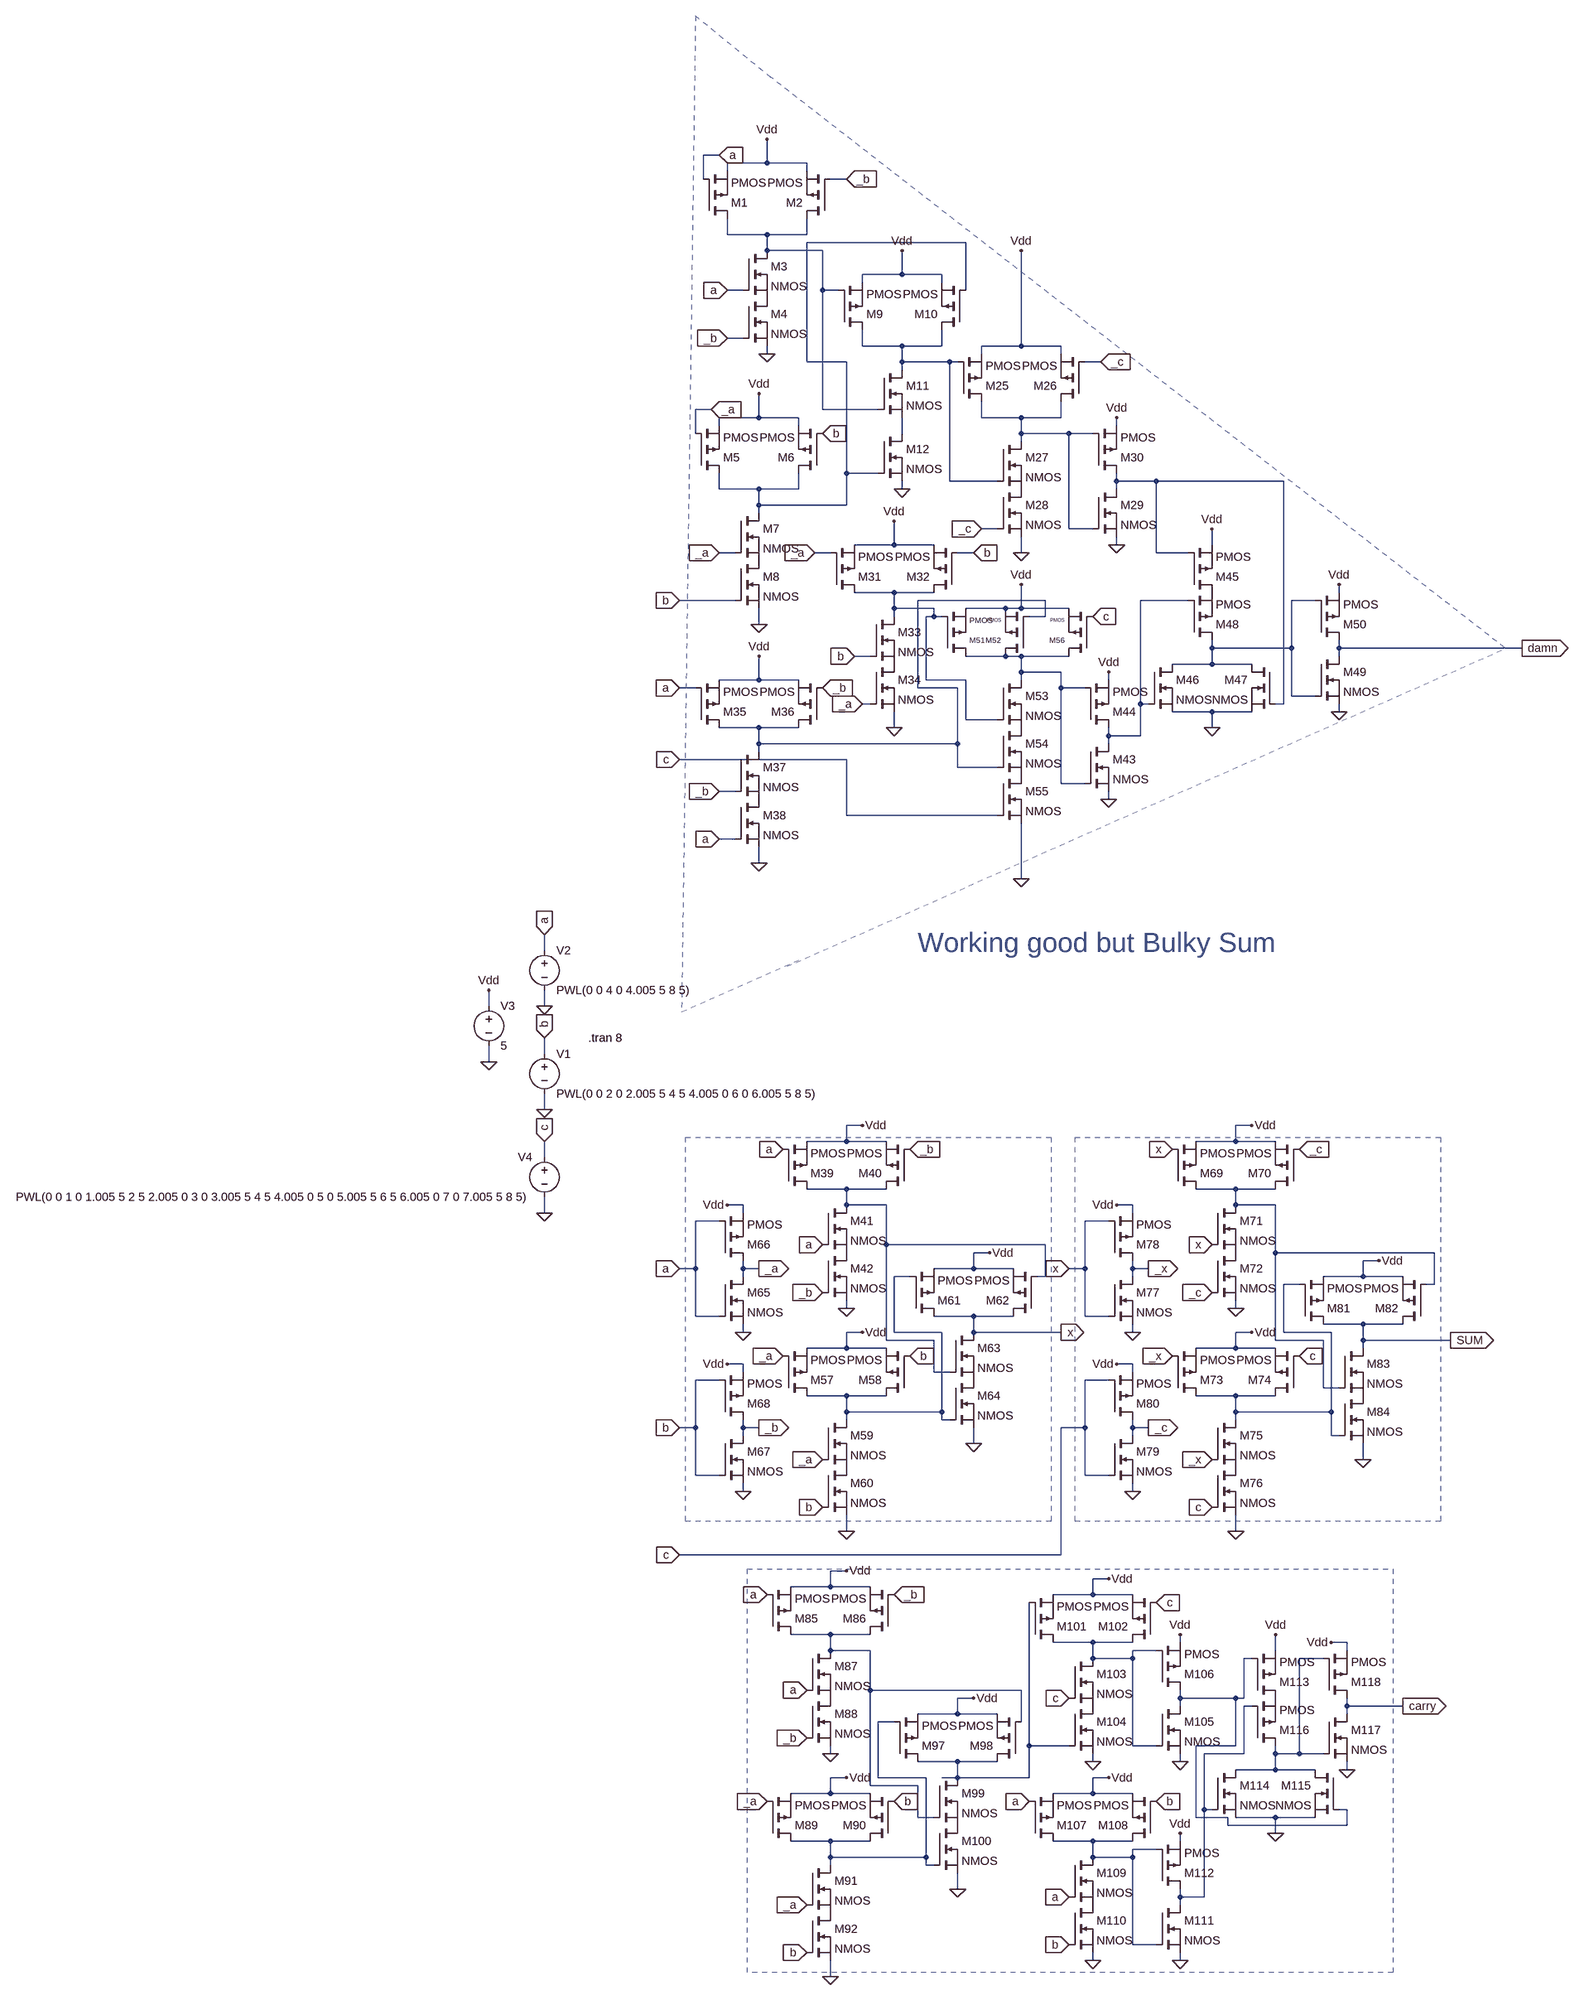
[diagram p0: schematic Full adder.asc]
Full adder.asc, the LTspice schematic file:
Version 4
SHEET 1 3796 2696
WIRE 816 -2448 784 -2448
WIRE 912 -2432 912 -2480
WIRE 912 -2432 832 -2432
WIRE 992 -2432 912 -2432
WIRE 832 -2416 832 -2432
WIRE 992 -2416 992 -2432
WIRE 784 -2400 784 -2448
WIRE 1072 -2400 1040 -2400
WIRE 832 -2288 832 -2320
WIRE 912 -2288 832 -2288
WIRE 992 -2288 992 -2320
WIRE 992 -2288 912 -2288
WIRE 1312 -2272 992 -2272
WIRE 912 -2256 912 -2288
WIRE 1024 -2256 912 -2256
WIRE 1184 -2208 1184 -2256
WIRE 1184 -2208 1104 -2208
WIRE 1264 -2208 1184 -2208
WIRE 1104 -2192 1104 -2208
WIRE 1264 -2192 1264 -2208
WIRE 864 -2176 832 -2176
WIRE 1024 -2176 1024 -2256
WIRE 1056 -2176 1024 -2176
WIRE 1312 -2176 1312 -2272
WIRE 864 -2080 832 -2080
WIRE 1104 -2064 1104 -2096
WIRE 1184 -2064 1104 -2064
WIRE 1264 -2064 1264 -2096
WIRE 1264 -2064 1184 -2064
WIRE 1424 -2064 1424 -2256
WIRE 1424 -2064 1344 -2064
WIRE 1504 -2064 1424 -2064
WIRE 912 -2048 912 -2064
WIRE 1344 -2048 1344 -2064
WIRE 1504 -2048 1504 -2064
WIRE 992 -2032 992 -2272
WIRE 1072 -2032 992 -2032
WIRE 1184 -2032 1184 -2064
WIRE 1280 -2032 1184 -2032
WIRE 1296 -2032 1280 -2032
WIRE 1584 -2032 1552 -2032
WIRE 1184 -2016 1184 -2032
WIRE 800 -1936 768 -1936
WIRE 1024 -1936 1024 -2176
WIRE 1136 -1936 1024 -1936
WIRE 896 -1920 896 -1968
WIRE 896 -1920 816 -1920
WIRE 976 -1920 896 -1920
WIRE 1344 -1920 1344 -1952
WIRE 1424 -1920 1344 -1920
WIRE 1504 -1920 1504 -1952
WIRE 1504 -1920 1424 -1920
WIRE 816 -1904 816 -1920
WIRE 976 -1904 976 -1920
WIRE 1616 -1904 1616 -1920
WIRE 768 -1888 768 -1936
WIRE 1184 -1888 1184 -1920
WIRE 1424 -1888 1424 -1920
WIRE 1520 -1888 1424 -1888
WIRE 1568 -1888 1520 -1888
WIRE 1424 -1872 1424 -1888
WIRE 1072 -1808 1072 -2032
WIRE 1136 -1808 1072 -1808
WIRE 1280 -1792 1280 -2032
WIRE 1376 -1792 1280 -1792
WIRE 1616 -1792 1616 -1808
WIRE 1696 -1792 1616 -1792
WIRE 1952 -1792 1696 -1792
WIRE 816 -1776 816 -1808
WIRE 896 -1776 816 -1776
WIRE 976 -1776 976 -1808
WIRE 976 -1776 896 -1776
WIRE 1184 -1776 1184 -1792
WIRE 1616 -1776 1616 -1792
WIRE 896 -1744 896 -1776
WIRE 1072 -1744 1072 -1808
WIRE 1072 -1744 896 -1744
WIRE 896 -1728 896 -1744
WIRE 1376 -1696 1344 -1696
WIRE 1520 -1696 1520 -1888
WIRE 1568 -1696 1520 -1696
WIRE 1168 -1664 1168 -1712
WIRE 1168 -1664 1088 -1664
WIRE 1248 -1664 1168 -1664
WIRE 1616 -1664 1616 -1680
WIRE 1808 -1664 1808 -1696
WIRE 848 -1648 816 -1648
WIRE 1040 -1648 1008 -1648
WIRE 1328 -1648 1296 -1648
WIRE 1424 -1648 1424 -1680
WIRE 1696 -1648 1696 -1792
WIRE 1760 -1648 1696 -1648
WIRE 1168 -1568 1088 -1568
WIRE 1248 -1568 1168 -1568
WIRE 2064 -1568 2064 -1584
WIRE 848 -1552 736 -1552
WIRE 1472 -1552 1216 -1552
WIRE 1760 -1552 1664 -1552
WIRE 2016 -1552 1968 -1552
WIRE 1168 -1536 1168 -1568
WIRE 1248 -1536 1168 -1536
WIRE 1392 -1536 1312 -1536
WIRE 1424 -1536 1424 -1584
WIRE 1424 -1536 1392 -1536
WIRE 1520 -1536 1424 -1536
WIRE 1168 -1520 1168 -1536
WIRE 1248 -1520 1248 -1536
WIRE 1248 -1520 1232 -1520
WIRE 1264 -1520 1248 -1520
WIRE 1472 -1520 1472 -1552
WIRE 1472 -1520 1440 -1520
WIRE 896 -1504 896 -1536
WIRE 1808 -1456 1808 -1472
WIRE 1968 -1456 1968 -1552
WIRE 1968 -1456 1808 -1456
WIRE 2064 -1456 2064 -1472
WIRE 2432 -1456 2064 -1456
WIRE 1120 -1440 1088 -1440
WIRE 1392 -1440 1312 -1440
WIRE 1424 -1440 1392 -1440
WIRE 1520 -1440 1424 -1440
WIRE 2064 -1440 2064 -1456
WIRE 1808 -1424 1808 -1456
WIRE 1808 -1424 1728 -1424
WIRE 1888 -1424 1808 -1424
WIRE 1424 -1408 1424 -1440
WIRE 1504 -1408 1424 -1408
WIRE 896 -1392 896 -1440
WIRE 896 -1392 816 -1392
WIRE 976 -1392 896 -1392
WIRE 1232 -1392 1232 -1520
WIRE 1312 -1392 1232 -1392
WIRE 1424 -1392 1424 -1408
WIRE 1600 -1392 1600 -1408
WIRE 768 -1376 736 -1376
WIRE 1216 -1376 1216 -1552
WIRE 1296 -1376 1216 -1376
WIRE 1504 -1376 1504 -1408
WIRE 1552 -1376 1504 -1376
WIRE 1968 -1360 1968 -1456
WIRE 2016 -1360 1968 -1360
WIRE 1120 -1344 1104 -1344
WIRE 1664 -1344 1664 -1552
WIRE 1680 -1344 1664 -1344
WIRE 1952 -1344 1952 -1792
WIRE 1952 -1344 1936 -1344
WIRE 1808 -1328 1728 -1328
WIRE 1888 -1328 1808 -1328
WIRE 2064 -1328 2064 -1344
WIRE 1312 -1312 1312 -1392
WIRE 1376 -1312 1312 -1312
WIRE 896 -1296 816 -1296
WIRE 976 -1296 896 -1296
WIRE 1168 -1296 1168 -1328
WIRE 1808 -1296 1808 -1328
WIRE 1600 -1280 1600 -1296
WIRE 1664 -1280 1664 -1344
WIRE 1664 -1280 1600 -1280
WIRE 896 -1264 896 -1296
WIRE 1296 -1264 1296 -1376
WIRE 1296 -1264 896 -1264
WIRE 1600 -1264 1600 -1280
WIRE 896 -1248 896 -1264
WIRE 1072 -1232 736 -1232
WIRE 1296 -1216 1296 -1264
WIRE 1376 -1216 1296 -1216
WIRE 1504 -1184 1504 -1376
WIRE 1552 -1184 1504 -1184
WIRE 848 -1168 816 -1168
WIRE 1600 -1152 1600 -1168
WIRE 1072 -1120 1072 -1232
WIRE 1376 -1120 1072 -1120
WIRE 848 -1072 816 -1072
WIRE 896 -1024 896 -1056
WIRE 1424 -992 1424 -1104
WIRE 464 -848 464 -880
WIRE 352 -736 352 -768
WIRE 464 -736 464 -768
WIRE 464 -640 464 -672
WIRE 352 -624 352 -656
WIRE 464 -528 464 -560
WIRE 1104 -496 1072 -496
WIRE 1888 -496 1856 -496
WIRE 1072 -464 1072 -496
WIRE 1072 -464 992 -464
WIRE 1152 -464 1072 -464
WIRE 1856 -464 1856 -496
WIRE 1856 -464 1776 -464
WIRE 1936 -464 1856 -464
WIRE 464 -432 464 -464
WIRE 1072 -368 992 -368
WIRE 1152 -368 1072 -368
WIRE 1856 -368 1776 -368
WIRE 1936 -368 1856 -368
WIRE 864 -336 832 -336
WIRE 1072 -336 1072 -368
WIRE 1152 -336 1072 -336
WIRE 1648 -336 1616 -336
WIRE 1856 -336 1856 -368
WIRE 1936 -336 1856 -336
WIRE 464 -320 464 -352
WIRE 864 -320 864 -336
WIRE 1648 -320 1648 -336
WIRE 816 -304 768 -304
WIRE 1600 -304 1552 -304
WIRE 1152 -256 1152 -336
WIRE 1472 -256 1152 -256
WIRE 1360 -240 1328 -240
WIRE 1936 -240 1936 -336
WIRE 2256 -240 1936 -240
WIRE 2144 -224 2112 -224
WIRE 768 -208 768 -304
WIRE 768 -208 736 -208
WIRE 864 -208 864 -224
WIRE 896 -208 864 -208
WIRE 1328 -208 1328 -240
WIRE 1328 -208 1248 -208
WIRE 1408 -208 1328 -208
WIRE 1552 -208 1552 -304
WIRE 1552 -208 1520 -208
WIRE 1648 -208 1648 -224
WIRE 1680 -208 1648 -208
WIRE 864 -192 864 -208
WIRE 1200 -192 1168 -192
WIRE 1472 -192 1472 -256
WIRE 1472 -192 1456 -192
WIRE 1648 -192 1648 -208
WIRE 2112 -192 2112 -224
WIRE 2112 -192 2032 -192
WIRE 2192 -192 2112 -192
WIRE 1984 -176 1952 -176
WIRE 2256 -176 2256 -240
WIRE 2256 -176 2240 -176
WIRE 1072 -128 1072 -144
WIRE 1856 -128 1856 -144
WIRE 768 -112 768 -208
WIRE 816 -112 768 -112
WIRE 1328 -112 1248 -112
WIRE 1408 -112 1328 -112
WIRE 1552 -112 1552 -208
WIRE 1600 -112 1552 -112
WIRE 2112 -96 2032 -96
WIRE 2192 -96 2112 -96
WIRE 864 -80 864 -96
WIRE 1104 -80 1072 -80
WIRE 1168 -80 1168 -192
WIRE 1264 -80 1168 -80
WIRE 1328 -80 1328 -112
WIRE 1504 -80 1328 -80
WIRE 1648 -80 1648 -96
WIRE 1888 -80 1856 -80
WIRE 1952 -80 1952 -176
WIRE 2048 -80 1952 -80
WIRE 1152 -64 1152 -256
WIRE 1248 -64 1152 -64
WIRE 1328 -64 1328 -80
WIRE 1936 -64 1936 -240
WIRE 2032 -64 1936 -64
WIRE 2112 -64 2112 -96
WIRE 2288 -64 2112 -64
WIRE 1072 -48 1072 -80
WIRE 1072 -48 992 -48
WIRE 1152 -48 1072 -48
WIRE 1856 -48 1856 -80
WIRE 1856 -48 1776 -48
WIRE 1936 -48 1856 -48
WIRE 2112 -48 2112 -64
WIRE 864 -16 832 -16
WIRE 1648 -16 1616 -16
WIRE 864 0 864 -16
WIRE 1248 0 1248 -64
WIRE 1280 0 1248 0
WIRE 1648 0 1648 -16
WIRE 816 16 768 16
WIRE 1600 16 1552 16
WIRE 2032 32 2032 -64
WIRE 2064 32 2032 32
WIRE 1072 48 992 48
WIRE 1152 48 1072 48
WIRE 1856 48 1776 48
WIRE 1936 48 1856 48
WIRE 1072 80 1072 48
WIRE 1264 80 1264 -80
WIRE 1264 80 1072 80
WIRE 1856 80 1856 48
WIRE 2048 80 2048 -80
WIRE 2048 80 1856 80
WIRE 1072 96 1072 80
WIRE 1264 96 1264 80
WIRE 1280 96 1264 96
WIRE 1856 96 1856 80
WIRE 768 112 768 16
WIRE 768 112 736 112
WIRE 864 112 864 96
WIRE 896 112 864 112
WIRE 1552 112 1552 16
WIRE 1552 112 1504 112
WIRE 1648 112 1648 96
WIRE 1680 112 1648 112
WIRE 864 128 864 112
WIRE 1648 128 1648 112
WIRE 2048 128 2048 80
WIRE 2064 128 2048 128
WIRE 1328 144 1328 112
WIRE 2112 176 2112 144
WIRE 768 208 768 112
WIRE 816 208 768 208
WIRE 1552 208 1552 112
WIRE 1600 208 1552 208
WIRE 864 240 864 224
WIRE 1648 240 1648 224
WIRE 1072 320 1072 288
WIRE 1856 320 1856 288
WIRE 1504 368 1504 112
WIRE 1504 368 736 368
WIRE 1072 400 1040 400
WIRE 1600 416 1568 416
WIRE 1040 432 1040 400
WIRE 1040 432 960 432
WIRE 1120 432 1040 432
WIRE 1568 448 1568 416
WIRE 1568 448 1488 448
WIRE 1648 448 1568 448
WIRE 1040 528 960 528
WIRE 1120 528 1040 528
WIRE 1568 544 1488 544
WIRE 1648 544 1568 544
WIRE 1744 544 1744 528
WIRE 2080 544 2048 544
WIRE 1040 560 1040 528
WIRE 1120 560 1040 560
WIRE 1696 560 1648 560
WIRE 1936 560 1936 528
WIRE 2080 560 2080 544
WIRE 1568 576 1568 544
WIRE 1648 576 1648 560
WIRE 1648 576 1568 576
WIRE 1888 576 1872 576
WIRE 2032 576 1984 576
WIRE 1120 640 1120 560
WIRE 1424 640 1120 640
WIRE 1328 656 1296 656
WIRE 1744 656 1744 640
WIRE 1856 656 1744 656
WIRE 1872 656 1872 576
WIRE 1872 656 1856 656
WIRE 1744 672 1744 656
WIRE 1888 672 1872 672
WIRE 2080 672 2080 656
WIRE 2192 672 2080 672
WIRE 1296 688 1296 656
WIRE 1296 688 1216 688
WIRE 1376 688 1296 688
WIRE 2080 688 2080 672
WIRE 1168 704 1136 704
WIRE 1424 704 1424 640
WIRE 1440 752 1440 464
WIRE 1520 752 1440 752
WIRE 1648 752 1648 576
WIRE 1696 752 1648 752
WIRE 1856 752 1856 656
WIRE 1856 752 1776 752
WIRE 1040 768 1040 752
WIRE 1872 768 1872 672
WIRE 1872 768 1792 768
WIRE 1936 768 1936 752
WIRE 1984 768 1984 576
WIRE 1984 768 1936 768
WIRE 2032 768 1984 768
WIRE 1296 784 1216 784
WIRE 1376 784 1296 784
WIRE 1568 784 1568 768
WIRE 1744 784 1744 768
WIRE 1936 800 1936 768
WIRE 1936 800 1856 800
WIRE 2016 800 1936 800
WIRE 2080 800 2080 784
WIRE 1072 816 1040 816
WIRE 1136 816 1136 704
WIRE 1232 816 1136 816
WIRE 1296 816 1296 784
WIRE 1296 816 1264 816
WIRE 1440 816 1440 752
WIRE 1440 816 1296 816
WIRE 1600 816 1568 816
WIRE 1120 832 1120 640
WIRE 1216 832 1120 832
WIRE 1040 848 1040 816
WIRE 1040 848 960 848
WIRE 1120 848 1040 848
WIRE 1568 848 1568 816
WIRE 1568 848 1488 848
WIRE 1648 848 1568 848
WIRE 1792 880 1792 768
WIRE 1808 880 1792 880
WIRE 2080 880 2064 880
WIRE 1216 896 1216 832
WIRE 1248 896 1216 896
WIRE 1776 896 1776 752
WIRE 1840 896 1776 896
WIRE 1936 896 1856 896
WIRE 2016 896 1936 896
WIRE 1840 912 1840 896
WIRE 2080 912 2080 880
WIRE 2080 912 1840 912
WIRE 1936 928 1936 896
WIRE 1040 944 960 944
WIRE 1120 944 1040 944
WIRE 1568 944 1488 944
WIRE 1648 944 1568 944
WIRE 1744 944 1744 928
WIRE 1696 960 1648 960
WIRE 1040 976 1040 944
WIRE 1232 976 1232 816
WIRE 1232 976 1040 976
WIRE 1568 976 1568 944
WIRE 1648 976 1648 960
WIRE 1648 976 1568 976
WIRE 1040 992 1040 976
WIRE 1232 992 1232 976
WIRE 1248 992 1232 992
WIRE 1296 1040 1296 1008
WIRE 1744 1056 1744 1040
WIRE 1792 1056 1792 880
WIRE 1792 1056 1744 1056
WIRE 1744 1072 1744 1056
WIRE 1648 1152 1648 976
WIRE 1696 1152 1648 1152
WIRE 1568 1184 1568 1168
WIRE 1744 1184 1744 1168
WIRE 1040 1216 1040 1184
FLAG 912 -2480 Vdd
FLAG 912 -2048 0
FLAG 832 -2080 _b
IOPIN 832 -2080 In
FLAG 832 -2176 a
IOPIN 832 -2176 In
FLAG 816 -2448 a
IOPIN 816 -2448 In
FLAG 1072 -2400 _b
IOPIN 1072 -2400 In
FLAG 896 -1968 Vdd
FLAG 896 -1504 0
FLAG 736 -1552 b
IOPIN 736 -1552 In
FLAG 816 -1648 _a
IOPIN 816 -1648 In
FLAG 800 -1936 _a
IOPIN 800 -1936 In
FLAG 1024 -1888 b
IOPIN 1024 -1888 In
FLAG 1184 -2256 Vdd
FLAG 1184 -1776 0
FLAG 464 -528 0
FLAG 464 -672 b
IOPIN 464 -672 In
FLAG 464 -736 0
FLAG 464 -880 a
IOPIN 464 -880 In
FLAG 352 -624 0
FLAG 352 -768 Vdd
FLAG 464 -320 0
FLAG 464 -464 c
IOPIN 464 -464 In
FLAG 1424 -2256 Vdd
FLAG 1424 -1648 0
FLAG 1344 -1696 _c
IOPIN 1344 -1696 In
FLAG 1584 -2032 _c
IOPIN 1584 -2032 In
FLAG 1616 -1664 0
FLAG 1616 -1920 Vdd
FLAG 1168 -1712 Vdd
FLAG 1168 -1296 0
FLAG 1104 -1344 _a
IOPIN 1104 -1344 In
FLAG 1088 -1440 b
IOPIN 1088 -1440 In
FLAG 1008 -1648 _a
IOPIN 1008 -1648 In
FLAG 1328 -1648 b
IOPIN 1328 -1648 In
FLAG 896 -1440 Vdd
FLAG 896 -1024 0
FLAG 816 -1072 a
IOPIN 816 -1072 In
FLAG 816 -1168 _b
IOPIN 816 -1168 In
FLAG 736 -1376 a
IOPIN 736 -1376 In
FLAG 1024 -1376 _b
IOPIN 1024 -1376 In
FLAG 1600 -1152 0
FLAG 1600 -1408 Vdd
FLAG 1808 -1696 Vdd
FLAG 1808 -1296 0
FLAG 2064 -1328 0
FLAG 2064 -1584 Vdd
FLAG 2432 -1456 damn
IOPIN 2432 -1456 Out
FLAG 1424 -1584 Vdd
FLAG 1424 -992 0
FLAG 736 -1232 c
IOPIN 736 -1232 In
FLAG 1568 -1520 c
IOPIN 1568 -1520 In
FLAG 1104 -496 Vdd
FLAG 1072 -128 0
FLAG 1024 -160 _b
IOPIN 1024 -160 In
FLAG 1024 -256 a
IOPIN 1024 -256 In
FLAG 944 -448 a
IOPIN 944 -448 In
FLAG 1200 -448 _b
IOPIN 1200 -448 In
FLAG 1104 -80 Vdd
FLAG 1072 320 0
FLAG 1024 272 b
IOPIN 1024 272 In
FLAG 1024 176 _a
IOPIN 1024 176 In
FLAG 944 -32 _a
IOPIN 944 -32 In
FLAG 1200 -32 b
IOPIN 1200 -32 In
FLAG 1504 -80 x
IOPIN 1504 -80 Out
FLAG 864 -80 0
FLAG 832 -336 Vdd
FLAG 896 -208 _a
IOPIN 896 -208 Out
FLAG 736 -208 a
IOPIN 736 -208 In
FLAG 864 240 0
FLAG 832 -16 Vdd
FLAG 896 112 _b
IOPIN 896 112 Out
FLAG 736 112 b
IOPIN 736 112 In
FLAG 1360 -240 Vdd
FLAG 1328 144 0
FLAG 1888 -496 Vdd
FLAG 1856 -128 0
FLAG 1808 -160 _c
IOPIN 1808 -160 In
FLAG 1808 -256 x
IOPIN 1808 -256 In
FLAG 1728 -448 x
IOPIN 1728 -448 In
FLAG 1984 -448 _c
IOPIN 1984 -448 In
FLAG 1888 -80 Vdd
FLAG 1856 320 0
FLAG 1808 272 c
IOPIN 1808 272 In
FLAG 1808 176 _x
IOPIN 1808 176 In
FLAG 1728 -32 _x
IOPIN 1728 -32 In
FLAG 1984 -32 c
IOPIN 1984 -32 In
FLAG 2288 -64 SUM
IOPIN 2288 -64 Out
FLAG 1648 -80 0
FLAG 1616 -336 Vdd
FLAG 1680 -208 _x
IOPIN 1680 -208 Out
FLAG 1520 -208 x
IOPIN 1520 -208 In
FLAG 1648 240 0
FLAG 1616 -16 Vdd
FLAG 1680 112 _c
IOPIN 1680 112 Out
FLAG 736 368 c
IOPIN 736 368 In
FLAG 2144 -224 Vdd
FLAG 2112 176 0
FLAG 1072 400 Vdd
FLAG 1040 768 0
FLAG 992 736 _b
IOPIN 992 736 In
FLAG 992 640 a
IOPIN 992 640 In
FLAG 912 448 a
IOPIN 912 448 In
FLAG 1168 448 _b
IOPIN 1168 448 In
FLAG 1072 816 Vdd
FLAG 1040 1216 0
FLAG 992 1168 b
IOPIN 992 1168 In
FLAG 992 1072 _a
IOPIN 992 1072 In
FLAG 912 864 _a
IOPIN 912 864 In
FLAG 1168 864 b
IOPIN 1168 864 In
FLAG 1328 656 Vdd
FLAG 1296 1040 0
FLAG 1600 416 Vdd
FLAG 1568 784 0
FLAG 1520 656 c
IOPIN 1520 656 In
FLAG 1696 464 c
IOPIN 1696 464 In
FLAG 1744 784 0
FLAG 1744 528 Vdd
FLAG 1600 816 Vdd
FLAG 1568 1184 0
FLAG 1520 1056 a
IOPIN 1520 1056 In
FLAG 1696 864 b
IOPIN 1696 864 In
FLAG 1440 864 a
IOPIN 1440 864 In
FLAG 1520 1152 b
IOPIN 1520 1152 In
FLAG 1744 1184 0
FLAG 1744 928 Vdd
FLAG 1936 528 Vdd
FLAG 1936 928 0
FLAG 2080 800 0
FLAG 2048 544 Vdd
FLAG 2192 672 carry
IOPIN 2192 672 Out
SYMBOL pmos 784 -2320 M180
SYMATTR InstName M1
SYMBOL pmos 1040 -2320 R180
SYMATTR InstName M2
SYMBOL nmos 864 -2256 R0
SYMATTR InstName M3
SYMBOL nmos 864 -2160 R0
SYMATTR InstName M4
SYMBOL pmos 768 -1808 M180
SYMATTR InstName M5
SYMBOL pmos 1024 -1808 R180
SYMATTR InstName M6
SYMBOL nmos 848 -1728 R0
SYMATTR InstName M7
SYMBOL nmos 848 -1632 R0
SYMATTR InstName M8
SYMBOL pmos 1056 -2096 M180
SYMATTR InstName M9
SYMBOL pmos 1312 -2096 R180
SYMATTR InstName M10
SYMBOL nmos 1136 -2016 R0
SYMATTR InstName M11
SYMBOL nmos 1136 -1888 R0
SYMATTR InstName M12
SYMBOL voltage 464 -656 R0
SYMATTR InstName V1
SYMATTR Value PWL(0 0 2 0 2.005 5 4 5 4.005 0 6 0 6.005 5 8 5)
SYMBOL voltage 464 -864 R0
SYMATTR InstName V2
SYMATTR Value PWL(0 0 4 0 4.005 5 8 5)
SYMBOL voltage 352 -752 R0
SYMATTR InstName V3
SYMATTR Value 5
SYMBOL voltage 464 -448 M0
SYMATTR InstName V4
SYMATTR Value PWL(0 0 1 0 1.005 5 2 5 2.005 0 3 0 3.005 5 4 5 4.005 0 5 0 5.005 5 6 5 6.005 0 7 0 7.005 5 8 5)
SYMBOL pmos 1296 -1952 M180
SYMATTR InstName M25
SYMBOL pmos 1552 -1952 R180
SYMATTR InstName M26
SYMBOL nmos 1376 -1872 R0
SYMATTR InstName M27
SYMBOL nmos 1376 -1776 R0
SYMATTR InstName M28
SYMBOL nmos 1568 -1776 R0
SYMATTR InstName M29
SYMBOL pmos 1568 -1808 M180
SYMATTR InstName M30
SYMBOL pmos 1040 -1568 M180
SYMATTR InstName M31
SYMBOL pmos 1296 -1568 R180
SYMATTR InstName M32
SYMBOL nmos 1120 -1520 R0
SYMATTR InstName M33
SYMBOL nmos 1120 -1424 R0
SYMATTR InstName M34
SYMBOL pmos 768 -1296 M180
SYMATTR InstName M35
SYMBOL pmos 1024 -1296 R180
SYMATTR InstName M36
SYMBOL nmos 848 -1248 R0
SYMATTR InstName M37
SYMBOL nmos 848 -1152 R0
SYMATTR InstName M38
SYMBOL nmos 1552 -1264 R0
SYMATTR InstName M43
SYMBOL pmos 1552 -1296 M180
SYMATTR InstName M44
SYMBOL pmos 1760 -1568 M180
SYMATTR InstName M45
SYMBOL nmos 1680 -1424 R0
SYMATTR InstName M46
SYMBOL nmos 1936 -1424 M0
SYMATTR InstName M47
SYMBOL pmos 1760 -1472 M180
SYMATTR InstName M48
SYMBOL nmos 2016 -1440 R0
SYMATTR InstName M49
SYMBOL pmos 2016 -1472 M180
SYMATTR InstName M50
SYMBOL pmos 1264 -1440 M180
WINDOW 0 56 32 Left 1
WINDOW 3 56 72 Left 1
SYMATTR InstName M51
SYMBOL pmos 1440 -1440 R180
WINDOW 0 56 32 Left 1
WINDOW 3 56 72 Left 0
SYMATTR InstName M52
SYMBOL nmos 1376 -1392 R0
SYMATTR InstName M53
SYMBOL nmos 1376 -1296 R0
SYMATTR InstName M54
SYMBOL nmos 1376 -1200 R0
SYMATTR InstName M55
SYMBOL pmos 1568 -1440 R180
WINDOW 0 56 32 Left 1
WINDOW 3 56 72 Left 0
SYMATTR InstName M56
SYMBOL pmos 944 -368 M180
SYMATTR InstName M39
SYMBOL pmos 1200 -368 R180
SYMATTR InstName M40
SYMBOL nmos 1024 -336 R0
SYMATTR InstName M41
SYMBOL nmos 1024 -240 R0
SYMATTR InstName M42
SYMBOL pmos 944 48 M180
SYMATTR InstName M57
SYMBOL pmos 1200 48 R180
SYMATTR InstName M58
SYMBOL nmos 1024 96 R0
SYMATTR InstName M59
SYMBOL nmos 1024 192 R0
SYMATTR InstName M60
SYMBOL nmos 816 -192 R0
SYMATTR InstName M65
SYMBOL pmos 816 -224 M180
SYMATTR InstName M66
SYMBOL nmos 816 128 R0
SYMATTR InstName M67
SYMBOL pmos 816 96 M180
SYMATTR InstName M68
SYMBOL pmos 1200 -112 M180
SYMATTR InstName M61
SYMBOL pmos 1456 -112 R180
SYMATTR InstName M62
SYMBOL nmos 1280 -80 R0
SYMATTR InstName M63
SYMBOL nmos 1280 16 R0
SYMATTR InstName M64
SYMBOL pmos 1728 -368 M180
SYMATTR InstName M69
SYMBOL pmos 1984 -368 R180
SYMATTR InstName M70
SYMBOL nmos 1808 -336 R0
SYMATTR InstName M71
SYMBOL nmos 1808 -240 R0
SYMATTR InstName M72
SYMBOL pmos 1728 48 M180
SYMATTR InstName M73
SYMBOL pmos 1984 48 R180
SYMATTR InstName M74
SYMBOL nmos 1808 96 R0
SYMATTR InstName M75
SYMBOL nmos 1808 192 R0
SYMATTR InstName M76
SYMBOL nmos 1600 -192 R0
SYMATTR InstName M77
SYMBOL pmos 1600 -224 M180
SYMATTR InstName M78
SYMBOL nmos 1600 128 R0
SYMATTR InstName M79
SYMBOL pmos 1600 96 M180
SYMATTR InstName M80
SYMBOL pmos 1984 -96 M180
SYMATTR InstName M81
SYMBOL pmos 2240 -96 R180
SYMATTR InstName M82
SYMBOL nmos 2064 -48 R0
SYMATTR InstName M83
SYMBOL nmos 2064 48 R0
SYMATTR InstName M84
SYMBOL pmos 912 528 M180
SYMATTR InstName M85
SYMBOL pmos 1168 528 R180
SYMATTR InstName M86
SYMBOL nmos 992 560 R0
SYMATTR InstName M87
SYMBOL nmos 992 656 R0
SYMATTR InstName M88
SYMBOL pmos 912 944 M180
SYMATTR InstName M89
SYMBOL pmos 1168 944 R180
SYMATTR InstName M90
SYMBOL nmos 992 992 R0
SYMATTR InstName M91
SYMBOL nmos 992 1088 R0
SYMATTR InstName M92
SYMBOL pmos 1168 784 M180
SYMATTR InstName M97
SYMBOL pmos 1424 784 R180
SYMATTR InstName M98
SYMBOL nmos 1248 816 R0
SYMATTR InstName M99
SYMBOL nmos 1248 912 R0
SYMATTR InstName M100
SYMBOL pmos 1440 544 M180
SYMATTR InstName M101
SYMBOL pmos 1696 544 R180
SYMATTR InstName M102
SYMBOL nmos 1520 576 R0
SYMATTR InstName M103
SYMBOL nmos 1520 672 R0
SYMATTR InstName M104
SYMBOL nmos 1696 672 R0
SYMATTR InstName M105
SYMBOL pmos 1696 640 M180
SYMATTR InstName M106
SYMBOL pmos 1440 944 M180
SYMATTR InstName M107
SYMBOL pmos 1696 944 R180
SYMATTR InstName M108
SYMBOL nmos 1520 976 R0
SYMATTR InstName M109
SYMBOL nmos 1520 1072 R0
SYMATTR InstName M110
SYMBOL nmos 1696 1072 R0
SYMATTR InstName M111
SYMBOL pmos 1696 1040 M180
SYMATTR InstName M112
SYMBOL pmos 1888 656 M180
SYMATTR InstName M113
SYMBOL nmos 1808 800 R0
SYMATTR InstName M114
SYMBOL nmos 2064 800 M0
SYMATTR InstName M115
SYMBOL pmos 1888 752 M180
SYMATTR InstName M116
SYMBOL nmos 2032 688 R0
SYMATTR InstName M117
SYMBOL pmos 2032 656 M180
SYMATTR InstName M118
TEXT 552 -672 Left 2 !.tran 8
TEXT 1216 -864 Left 5 ;Working good but Bulky Sum
LINE Normal 952 -816 2400 -1456 2
LINE Normal 916 -2608 2404 -1452 2
LINE Normal 976 -828 740 -724 2
LINE Normal 920 -2604 768 -2728 2
LINE Normal 768 -2728 740 -724 2
RECTANGLE Normal 748 -472 1484 300 2
RECTANGLE Normal 1532 -472 2268 300 2
RECTANGLE Normal 2172 1208 872 396 2

The netlist it stands for:
* Full adder.asc
M1 N001 a Vdd Vdd PMOS
M2 N001 _b Vdd Vdd PMOS
M3 N001 a P001 P001 NMOS
M4 P001 _b 0 0 NMOS
M5 N002 _a Vdd Vdd PMOS
M6 N002 b Vdd Vdd PMOS
M7 N002 _a P002 P002 NMOS
M8 P002 b 0 0 NMOS
M9 N003 N001 Vdd Vdd PMOS
M10 N003 N002 Vdd Vdd PMOS
M11 N003 N001 N005 N005 NMOS
M12 N005 N002 0 0 NMOS
V1 b 0 PWL(0 0 2 0 2.005 5 4 5 4.005 0 6 0 6.005 5 8 5)
V2 a 0 PWL(0 0 4 0 4.005 5 8 5)
V3 Vdd 0 5
V4 c 0 PWL(0 0 1 0 1.005 5 2 5 2.005 0 3 0 3.005 5 4 5 4.005 0 5 0 5.005 5 6 5 6.005 0 7 0 7.005 5 8 5)
M25 N004 N003 Vdd Vdd PMOS
M26 N004 _c Vdd Vdd PMOS
M27 N004 N003 P003 P003 NMOS
M28 P003 _c 0 0 NMOS
M29 N006 N004 0 0 NMOS
M30 N006 N004 Vdd Vdd PMOS
M31 N007 _a Vdd Vdd PMOS
M32 N007 b Vdd Vdd PMOS
M33 N007 b P004 P004 NMOS
M34 P004 _a 0 0 NMOS
M35 N008 a Vdd Vdd PMOS
M36 N008 _b Vdd Vdd PMOS
M37 N008 _b P005 P005 NMOS
M38 P005 a 0 0 NMOS
M43 N009 N011 0 0 NMOS
M44 N009 N011 Vdd Vdd PMOS
M45 P006 N006 Vdd Vdd PMOS
M46 N010 N009 0 0 NMOS
M47 N010 N006 0 0 NMOS
M48 N010 N009 P006 P006 PMOS
M49 damn N010 0 0 NMOS
M50 damn N010 Vdd Vdd PMOS
M51 N011 N007 Vdd Vdd PMOS
M52 N011 N008 Vdd Vdd PMOS
M53 N011 N007 P007 P007 NMOS
M54 P007 N008 P008 P008 NMOS
M55 P008 c 0 0 NMOS
M56 N011 c Vdd Vdd PMOS
M39 N012 a Vdd Vdd PMOS
M40 N012 _b Vdd Vdd PMOS
M41 N012 a P009 P009 NMOS
M42 P009 _b 0 0 NMOS
M57 N014 _a Vdd Vdd PMOS
M58 N014 b Vdd Vdd PMOS
M59 N014 _a P010 P010 NMOS
M60 P010 b 0 0 NMOS
M65 _a a 0 0 NMOS
M66 _a a Vdd Vdd PMOS
M67 _b b 0 0 NMOS
M68 _b b Vdd Vdd PMOS
M61 x N014 Vdd Vdd PMOS
M62 x N012 Vdd Vdd PMOS
M63 x N012 P011 P011 NMOS
M64 P011 N014 0 0 NMOS
M69 N013 x Vdd Vdd PMOS
M70 N013 _c Vdd Vdd PMOS
M71 N013 x P012 P012 NMOS
M72 P012 _c 0 0 NMOS
M73 N015 _x Vdd Vdd PMOS
M74 N015 c Vdd Vdd PMOS
M75 N015 _x P013 P013 NMOS
M76 P013 c 0 0 NMOS
M77 _x x 0 0 NMOS
M78 _x x Vdd Vdd PMOS
M79 _c c 0 0 NMOS
M80 _c c Vdd Vdd PMOS
M81 SUM N015 Vdd Vdd PMOS
M82 SUM N013 Vdd Vdd PMOS
M83 SUM N013 P014 P014 NMOS
M84 P014 N015 0 0 NMOS
M85 N016 a Vdd Vdd PMOS
M86 N016 _b Vdd Vdd PMOS
M87 N016 a P015 P015 NMOS
M88 P015 _b 0 0 NMOS
M89 N021 _a Vdd Vdd PMOS
M90 N021 b Vdd Vdd PMOS
M91 N021 _a P016 P016 NMOS
M92 P016 b 0 0 NMOS
M97 N022 N021 Vdd Vdd PMOS
M98 N022 N016 Vdd Vdd PMOS
M99 N022 N016 P017 P017 NMOS
M100 P017 N021 0 0 NMOS
M101 N017 N022 Vdd Vdd PMOS
M102 N017 c Vdd Vdd PMOS
M103 N017 c P018 P018 NMOS
M104 P018 N022 0 0 NMOS
M105 N018 N017 0 0 NMOS
M106 N018 N017 Vdd Vdd PMOS
M107 N023 a Vdd Vdd PMOS
M108 N023 b Vdd Vdd PMOS
M109 N023 a P019 P019 NMOS
M110 P019 b 0 0 NMOS
M111 N020 N023 0 0 NMOS
M112 N020 N023 Vdd Vdd PMOS
M113 P020 N018 Vdd Vdd PMOS
M114 N019 N020 0 0 NMOS
M115 N019 N018 0 0 NMOS
M116 N019 N020 P020 P020 PMOS
M117 carry N019 0 0 NMOS
M118 carry N019 Vdd Vdd PMOS
.model NMOS NMOS
.model PMOS PMOS
.lib standard.mos
.tran 8
* Working good but Bulky Sum
.backanno
.end